# Altium project I2C_Expander.PrjPcb
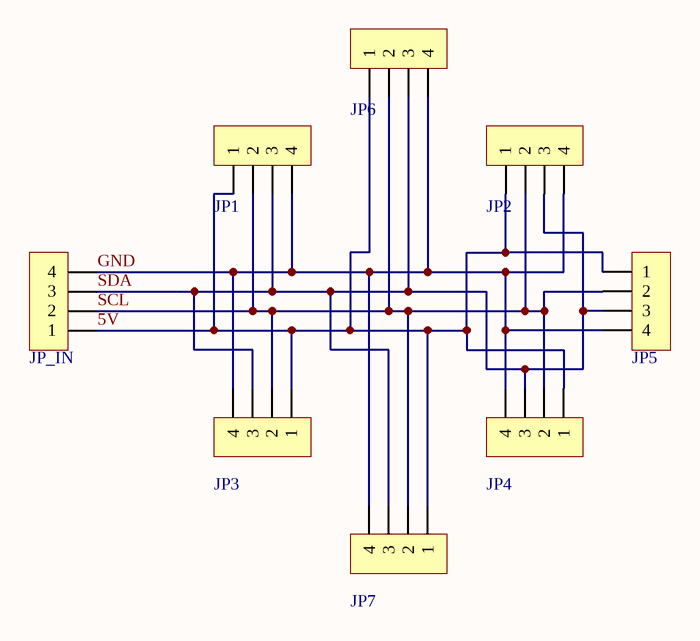
[diagram p0: I2C_Expander.SchDoc]
1 sheet, 8 parts. Net scope: global (net labels, ports and power ports of the same name join across sheets).
Board file: I2C_Expander.PcbDoc

## Sheet I2C_Expander.SchDoc
size A4

### Parts
JP1  HDR-1X4  [MX 1.25-WS-4P]  (value not drawn)
JP2  HDR-1X4  [MX 1.25-WS-4P]  (value not drawn)
JP3  HDR-1X4  [MX 1.25-WS-4P]  (value not drawn)
JP4  HDR-1X4  [MX 1.25-WS-4P]  (value not drawn)
JP5  HDR-1X4  [HDR2.54-LI-4P]  (value not drawn)
JP6  HDR-1X4  [HDR2.54-LI-4P]  (value not drawn)
JP7  HDR-1X4  [HDR2.54-LI-4P]  (value not drawn)
JP_IN  HDR-1X4  [MX 1.25-WS-4P]  (value not drawn)

### Nets
5V: JP1.1 JP2.1 JP3.1 JP4.1 JP5.1 JP6.1 JP7.1 JP_IN.1
GND: JP1.4 JP2.4 JP3.4 JP4.4 JP5.4 JP6.4 JP7.4 JP_IN.4
SCL: JP1.2 JP2.2 JP3.2 JP4.2 JP5.2 JP6.2 JP7.2 JP_IN.2
SDA: JP1.3 JP2.3 JP3.3 JP4.3 JP5.3 JP6.3 JP7.3 JP_IN.3

### Library data of the parts
JP1-JP7 JP_IN = Header 4: 4P接插件; 版权归属: 源创客; BOM名称: 4P接插件; 学习资源: www.ooocke.com